# Altium schematic sheet SWITCHING.SchDoc
size 420 x 297 mm; SheetNumber: 4; SheetTotal: 4
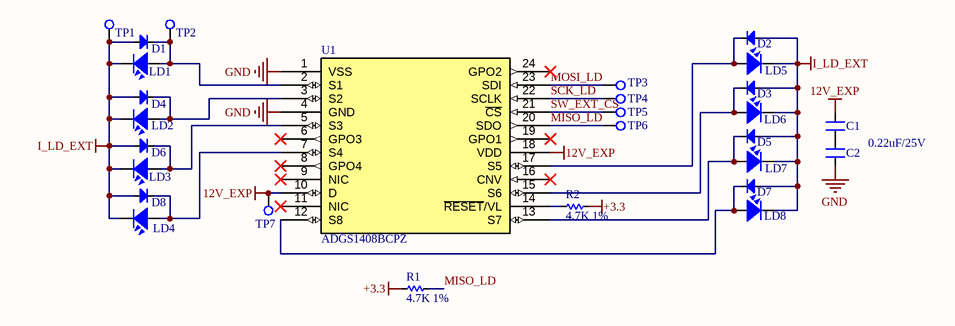
[diagram p0: SWITCHING.SchDoc]

## Parts
C1  0.22uF/25V  [SM-0603]  (value not drawn)
C2  0.22uF/25V  [SM-0603]
D1  1N4148W-TP  [SOD23]  (value not drawn)
D2  1N4148W-TP  [SOD23]  (value not drawn)
D3  1N4148W-TP  [SOD23]  (value not drawn)
D4  1N4148W-TP  [SOD23]  (value not drawn)
D5  1N4148W-TP  [SOD23]  (value not drawn)
D6  1N4148W-TP  [SOD23]  (value not drawn)
D7  1N4148W-TP  [SOD23]  (value not drawn)
D8  1N4148W-TP  [SOD23]  (value not drawn)
LD1  LaserDiode  [LASER]  (value not drawn)
LD2  LaserDiode  [LASER]  (value not drawn)
LD3  LaserDiode  [LASER]  (value not drawn)
LD4  LaserDiode  [LASER]  (value not drawn)
LD5  LaserDiode  [LASER]  (value not drawn)
LD6  LaserDiode  [LASER]  (value not drawn)
LD7  LaserDiode  [LASER]  (value not drawn)
LD8  LaserDiode  [LASER]  (value not drawn)
R1  4.7K 1%  [RES-SMD-0603]
R2  4.7K 1%  [RES-SMD-0603]
TP1  Test_Point  [TESTPOINT]  (value not drawn)
TP2  Test_Point  [TESTPOINT]  (value not drawn)
TP3  Test_Point  [TESTPOINT]  (value not drawn)
TP4  Test_Point  [TESTPOINT]  (value not drawn)
TP5  Test_Point  [TESTPOINT]  (value not drawn)
TP6  Test_Point  [TESTPOINT]  (value not drawn)
TP7  Test_Point  [TESTPOINT]  (value not drawn)
U1  ADGS1408BCPZ  [ADGS1408BCPZ]

## Nets
12V_EXP: C1.2 TP7.1 U1.10(D) U1.18(VDD)
+3.3: R1.2 R2.1
GND: C2.1 U1.1(VSS) U1.4(GND)
I_LD_EXT: D1.1(A) D2.1(A) D3.1(A) D4.1(A) D5.1(A) D6.1(A) D7.1(A) D8.1(A) LD1.3 LD2.3 LD3.3 LD4.3 LD5.3 LD6.3 LD7.3 LD8.3 TP1.1
MISO_LD: R1.1 TP6.1 U1.20(SDO)
MOSI_LD: TP3.1 U1.23(SDI)
SCK_LD: TP4.1 U1.22(SCLK)
SW_EXT_CS: TP5.1 U1.21(~{CS})
NetC1_1: C1.1 C2.2
NetD1_2: D1.2(K) LD1.1 TP2.1 U1.2(S1)
NetD2_2: D2.2(K) LD5.1 U1.17(S5)
NetD3_2: D3.2(K) LD6.1 U1.15(S6)
NetD4_2: D4.2(K) LD2.1 U1.3(S2)
NetD5_2: D5.2(K) LD7.1 U1.13(S7)
NetD6_2: D6.2(K) LD3.1 U1.5(S3)
NetD7_2: D7.2(K) LD8.1 U1.12(S8)
NetD8_2: D8.2(K) LD4.1 U1.7(S4)
NetR2_2: R2.2 U1.14(~{RESET}/VL)

Not connected (* = marked no-connect by the designer): U1 6(GPO3)* 8(GPO4)* 9(NIC)* 11(NIC)* 16(CNV)* 19(GPO1)* 24(GPO2)*

## Notes on the sheet
- Project:
- BEE-PC1
- Sub-system:
- Design by:
- Hung Nguyen D.
- Bao Bui Q.
- Sheet title:
- Sheet
- A3
- of
- Checked by:
- Approved by:
- Vu Pham
- Revision:
- Document No:
- V1.2.0
- Size:
- Date:

## Library data of the parts
C1 C2 = CM: 0603; Value: 103
D1-D8 = Diode SMD: DIODE GEN PURP 100V 150MA SOD123; Code - JEDEC: DO-214-AB; Value: 1N5007; Published: 8-Jun-2000; Revision: July-2002: Re-released for DXP Platform.; Publisher: Altium Limited
LD1-LD8 = LD
R1 R2 = Res-SMD: 0603; Manufacturer: Generic Components; Class: Passive; Published: 08/06/2000; Publisher: Altium Hobart Technology Centre
U1 = ADGS1408: IC MUX 8:1 4.7OHM 24LFCSP